# EAGLE schematic ESP8266 RFID Schematic (EAGLE 9.6.2)
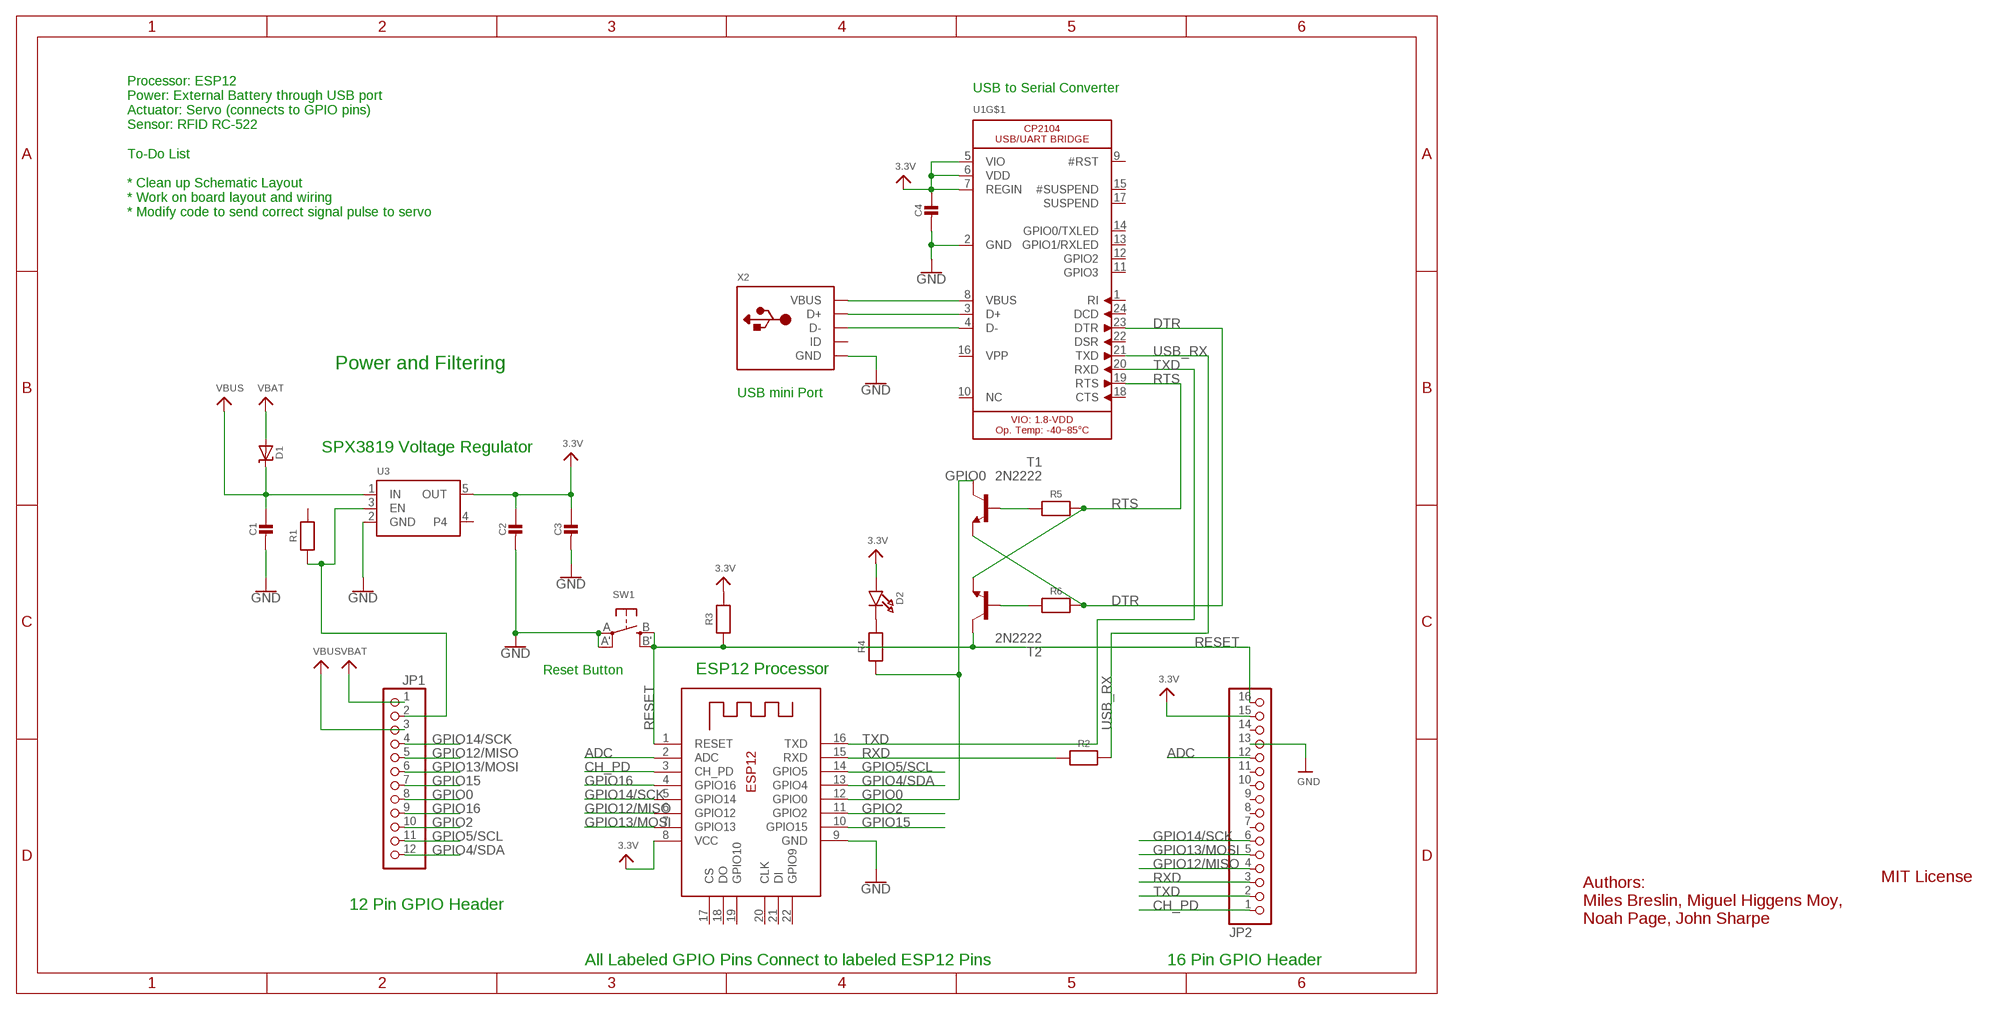
[diagram p0: schematic, sheet 1]

## Parts
C1  CAP_CERAMIC0603MINI  [0603-MINI]
C2  CAP_CERAMIC0603MINI  [0603-MINI]
C3  CAP_CERAMIC0603MINI  [0603-MINI]
C4  CAP_CERAMIC0603MINI  [0603-MINI]
D1  DIODE-SCHOTTKYDO-1N4148  [DO-1N4148]
D2  LED0603  [CHIPLED_0603]
JP1  HEADER-1X12  [1X12_ROUND]
JP2  HEADER-1X16  [1X16_OVAL]
R1  RESISTOR0603MINI  [0603-MINI]
R2  RESISTOR0603MINI  [0603-MINI]
R3  RESISTOR0603MINI  [0603-MINI]
R4  RESISTOR0603MINI  [0603-MINI]
R5  RESISTOR0603MINI  [0603-MINI]
R6  RESISTOR0603MINI  [0603-MINI]
SW1  SWITCH_TACT_SMT  [EVQ-Q2]
T1  2N2222  [TO92-EBC-OVAL]
T2  2N2222  [TO92-EBC-OVAL]
U1  CP2104  [QFN24_4MM_SMSC]
U3  VREG_SOT23-5  [SOT23-5]
X1  ESP-12E  [ESP-12E]
X2  USBMINIB  [USB-MINIB]

## Nets
3.3V: C4.1 D2.A JP2.15 R3.2 U1.5(VIO) U1.6(VDD) U1.7(REGIN) X1.8(VCC)
ADC: JP2.12 X1.2(ADC)
CH_PD: JP2.1 X1.3(CH_PD)
DTR: R6.2 T1.E U1.23(DTR)
GND: C1.2 C2.2 C3.2 C4.2 JP2.13 SW1.A'(P1) SW1.A(P) U1.2(GND) U3.2(GND) X1.9(GND) X2.GND X2.GND1(GND) X2.GND2(GND) X2.GND3(GND) X2.GND4(GND)
GPIO0: JP1.8 R4.1 T1.C X1.12(GPIO0)
GPIO2: JP1.10 X1.11(GPIO2)
GPIO4/SDA: JP1.12 X1.13(GPIO4)
GPIO5/SCL: JP1.11 X1.14(GPIO5)
GPIO12/MISO: JP1.5 JP2.4 X1.6(GPIO12)
GPIO13/MOSI: JP1.6 JP2.5 X1.7(GPIO13)
GPIO14/SCK: JP1.4 JP2.6 X1.5(GPIO14)
GPIO15: JP1.7 X1.10(GPIO15)
GPIO16: JP1.9 X1.4(GPIO16)
N$1: JP1.2 R1.1 U3.3(EN)
N$2: U1.8(VBUS) X2.VBUS
N$3: U1.3(D+) X2.D+
N$4: U1.4(D-) X2.D-
N$5: D2.C R4.2
N$6: R5.1 T1.B
N$7: R6.1 T2.B
OUT: C2.1 C3.1 U3.5(OUT) ; supply symbol labelled 3.3V
RESET: JP2.16 R3.1 SW1.B'(S1) SW1.B(S) T2.C X1.1(RESET)
RTS: R5.2 T2.E U1.19(RTS)
RXD: JP2.3 R2.1 X1.15(RXD)
TXD: JP2.2 U1.20(RXD) X1.16(TXD)
USB_RX: R2.2 U1.21(TXD)
VBAT: D1.A JP1.1
VBUS: C1.1 D1.C JP1.3 U3.1(IN)
Unconnected: JP2.7 JP2.8 JP2.9 JP2.10 JP2.11 JP2.14 R1.2 U1.1(RI) U1.9(#RST) U1.10(NC) U1.11(GPIO3) U1.12(GPIO2) U1.13(GPIO1/RXLED) U1.14(GPIO0/TXLED) U1.15(#SUSPEND) U1.16(VPP) U1.17(SUSPEND) U1.18(CTS) U1.22(DSR) U1.24(DCD) U3.4 X1.17(CS) X1.18(DO) X1.19(GPIO10) X1.20(CLK) X1.21(DI) X1.22(GPIO9) X2.ID

## Notes on the sheet
- USB to Serial Converter
- Processor: ESP12
  Power: External Battery through USB port
  Actuator: Servo (connects to GPIO pins)
  Sensor: RFID RC-522
  
  To-Do List
  
  * Clean up Schematic Layout
  * Work on board layout and wiring
  * Modify code to send correct signal pulse to servo
- Power and Filtering
- USB mini Port
- SPX3819 Voltage Regulator
- Reset Button | ESP12 Processor
- MIT License
- 12 Pin GPIO Header
- Authors:
  Miles Breslin, Miguel Higgens Moy, 
  Noah Page, John Sharpe
- All Labeled GPIO Pins Connect to labeled ESP12 Pins | 16 Pin GPIO Header

## Power pins joined to a net without a drawn wire
TP: U1.THERM(TP)

## Library data of the parts
C1-C4 = microbuilder:CAP_CERAMIC: Ceramic Capacitors For new designs, use the packages preceded by an '_' character since they are more reliable: The following footprints should be used on most boards: _0402 - Standard footprint for regular board layouts _0603 - Standard footprint for regular board layouts _0805 - Standard footprint for regular board layouts _1206 - Standard footprint for regular board layouts For extremely tight-pitch boards where space is at a premium, the following 'micro-pitch' footprints can be used (smaller pads, no silkscreen outline, etc.): _0402MP - Micro-pitch footprint for very dense/compact boards _0603MP - Micro-pitch footprint for very dense/compact boards _0805MP - Micro-pitch footprint for very dense/compact boards _1206MP - Micro-pitch footprint for very dense/compact boards
D1 = microbuilder:DIODE-SCHOTTKY
D2 = microbuilder:LED: LED 0603 - 0603 Surface Mount Package 2mA: Green LED - Low Power (3.9mcd, 2ma, 1.7Vf) - Digikey: 475-2709-2-ND Orange LED - Low Power (9.8mcd, 2ma, 1.8Vf) - Digikey: 475-1194-2-ND Red LED - Low Power (5mcd, 2ma, 1.8Vf) - Digikey: 475-1195-2-ND Yellow LED - Low Power (7mcd, 2ma, 1.8Vf) - Digikey: 475-1196-2-ND 5mA: Blue LED - Low Power (17mcd, 5ma, 2.9Vf) - Digikey: LNJ937W8CRACT-ND 0805 - 0805 Surface Mount Package 2mA: Red LED (8.8mcd, 2mA, 1.8Vf, Clear) - Low Power [Digikey: 475-2510-1-ND] Green LED (5mcd, 2mA, 1.8Vf, Clear) - Low Power [Digikey: 475-2730-1-ND] Yellow LED (11.3mcd, 2mA, 1.8Vf, Clear) - Low Power [Digikey: 475-2555-1-ND] 20mA: Red LED (104mcd, 20mA, Diffused) - LS R976 [Digikey: 475-1278-6-ND] Red LED (12mcd, 20mA, 2.0Vf, Clear) - APT2012EC [Digikey: 754-1128-1-ND] Green LED (15mcd, 20mA, 2.2Vf, Clear) - APT2012GC [Digikey: 754-1131-1-ND] Orange LED (160mcd, 20mA, 2.1Vf, Clear) - APT2012SECK [Digikey: 754-1130-1-ND] 1206 - 1206 Surface Mount Package Green LED (26mcd, 20mA, Diffused) - LG N971 [Digikey: 475-1407-6-ND] Red LED (15mcd, 20mA, Diffused) - LH N974 [Digikey: 475-1416-6-ND] Cree - Cree High-Power Surface Mount LEDs XPEBWT-L1-0000-00D50 - White 111lm 350mA 2.9Vf 6200K 110° XTEAWT-00-0000-00000LEE3 - White 114lm 350mA 2.85Vf 5000K 115° Everlight - Everlight 45-21 Series Surface Mount LEDs 45-21/QK2C-B2832AC2CB2/2T - Warm White 2000mcd 20mA 3.25Vf 3050K 120° 45-21/LK2C-B38452C4CB2/2T - Nuetral White 2000mcd 20mA 3.25Vf 4150K 120° 45-21/LK2C-B50634C6CB2/2T - Cold White 2200mcd 20mA 3.25Vf 5650K 120° PLCC2 Reverse Mount LS T77K-J1L2-1-0-2-R18-Z - Red 11.25mcd 2mA 1.8Vf 630nm 120° LO T77K-L1M2-24-Z - Orange 19.6mcd 2mA 1.8Vf 606nm 120° LY T77K-K2M1-26-Z - Yellow 15.7mcd 2mA 1.8Vf 587nm 120°
JP1 = microbuilder:HEADER-1X12
JP2 = microbuilder:HEADER-1X16: PIN HEADER
R1-R6 = microbuilder:RESISTOR: Resistors For new designs, use the packages preceded by an '_' character since they are more reliable: The following footprints should be used on most boards: _0402 - Standard footprint for regular board layouts _0603 - Standard footprint for regular board layouts _0805 - Standard footprint for regular board layouts _1206 - Standard footprint for regular board layouts For extremely tight-pitch boards where space is at a premium, the following 'micro-pitch' footprints can be used (smaller pads, no silkscreen outline, etc.): _0402MP - Micro-pitch footprint for very dense/compact boards _0603MP - Micro-pitch footprint for very dense/compact boards _0805MP - Micro-pitch footprint for very dense/compact boards _1206MP - Micro-pitch footprint for very dense/compact boards
SW1 = microbuilder:SWITCH_TACT_SMT: SMT Tact Switches 6x6mm - Digikey: P12940SCT-ND KMR2 (4.6x2.8mm) - Digikey: 401-1426-1-ND EVQ-PQHB55 - Light Touch, 160GF (4.5x4.5mm) - Digikey: P8090SCT-ND KMT0 - KMT021 NGJ LHS (etc.) IP68/Waterproof - Digikey: CKN10289CT-ND
T1 T2 = adafruit:2N2222: NPN TRANSISTOR Big oval pads
U1 = microbuilder:CP2104: CP2104 - USB to UART Bridge VDD Output: 3.45V
U3 = microbuilder:VREG_SOT23-5: SOT23-5 Fixed Voltage Regulators Part Current Out V Out V In V Dropout θJA (°C/W) TJ (°C) Digikey Part No. ADP121 150mA 3.3V 3.4-5.5V 0.09V @ 150mA -- -- ADP121-AUJZ33R7CT-ND ADP121 150mA 3.0V 3.1-5.5V 0.09V @ 150mA -- -- ADP121-AUJZ30R7CT-ND ADP122 300mA 3.3V 3.4-5.5V 0.085V @ 300mA -- -- ADP122AUJZ-3.3-R7CT-ND ADP1712 300mA 3.3V 3.5-5.5V 0.17V @ 300mA -- -- ADP1712AUJZ-3.3-R7TR-ND AP7311 (Low Cost) 150mA 3.3V 3.5-6V 0.15V @ 150mA -- -- AP7311-33WG-7DICT-ND LD39015M18R 150mA 1.8V 1.9V-5.5V 0.08V @ 100mA -- -- 497-6977-1-ND LP2985A-33DBVR 150mA 3.3V 3.3-16V 0.28V @ 150mA 206 150 296-18479-1-ND MCP1824T-3302E/OT 300mA 3.3V 3.5V-6V 0.2V @ 300mA -- -- MCP1824T-3302E/OTCT-ND MIC5205-2.5YM5 TR 150mA 2.5V 2.7-16V 0.165V @ 150mA -- -- 576-1257-2-ND MIC5205-3.0YM5 TR 150mA 3.0V 3.2V-16V 0.165V @ 150mA -- -- 576-1258-2-ND MIC5205-3.3YM5 TR 150mA 3.3V 3.5V-16V 0.165V @ 150mA -- -- 576-1259-2-ND TPS780330220 150mA 3.3V+2.2V 3.6-5.5V 250mV Max -- -- 296-23332-1-ND TDA3663/N1,135 100mA 3.3V 3.5-45V 0.18V @ 50mA -- -- 568-5343-1-ND Max operating temp can be calculated using θJA, TJ (max junction temperature), and power in watts. Set the "Maximum Ambient Temperature" until it reaches TJ ("Max Junction Temperature"), which is the absolute limit for safe use of the regulator: Heat Sink Temperature Calculator <http://www.daycounter.com/Calculators/Heat-Sink-Temperature-Calculator.phtml> For example, With 12V source into a 3.3V LP2985 and a 30mA load, we are dissipating (12V-3.3V) * 0.03A = 0.261W. With a θJA of 206 °C/W, a TJ of 150°C, and 261mW we can safely use the chip without a heat sink up to 75°C (=147.1°C Junction Temperature).
X1 = microbuilder:ESP-12E
X2 = microbuilder:USB: USB Connectors USBMINIB - Surface Mount Female Mini-B USB Connector 4UConnector: 06564